# Altium schematic sheet Вариант3.SchDoc
size A4; SheetNumber: 3; SheetTotal: 10
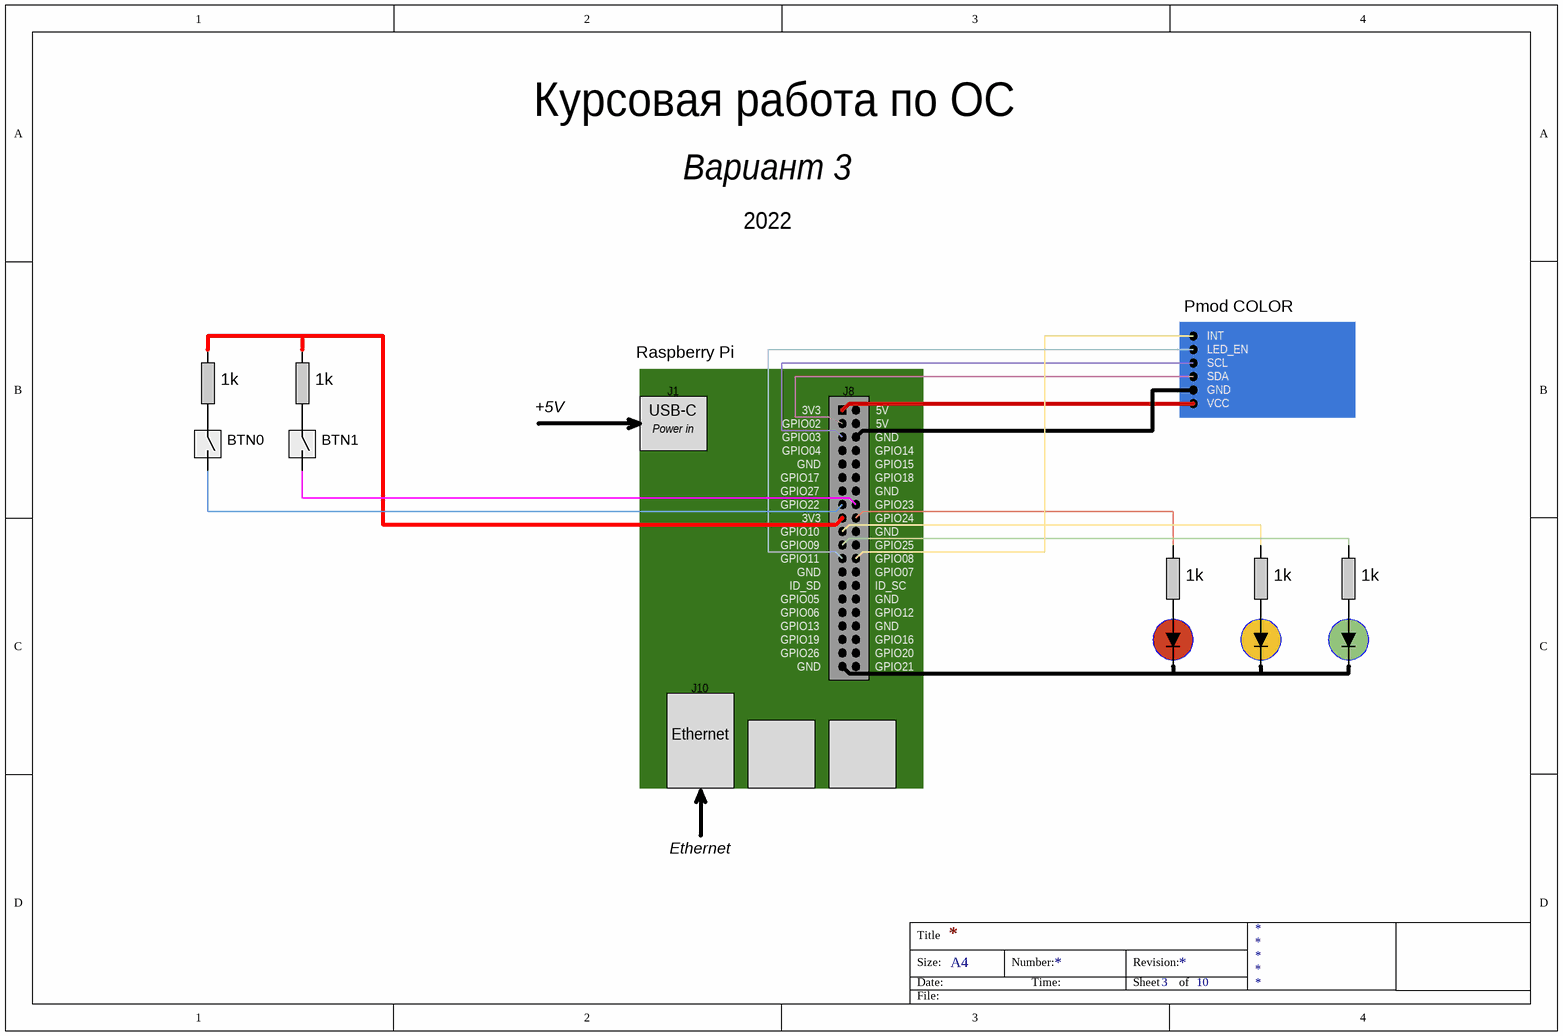
[diagram p0: Вариант3.SchDoc]

## Notes on the sheet
- Курсовая работа по ОС
- Вариант 3
- 2022
- Pmod COLOR
- 1k
- Raspberry Pi
- J1
- J8
- INT
- LED_EN
- SCL
- SDA
- GND
- BTN0
- BTN1
- +5V
- USB-C
- Power in
- 3V3
- GPIO02
- GPIO03
- GPIO04
- GPIO14
- 5V
- VCC
- GPIO17
- GPIO27
- GPIO22
- GPIO15
- GPIO18
- GPIO23
- GPIO24
- GPIO09
- GPIO10
- GPIO11
- ID_SD
- GPIO25
- GPIO08
- GPIO07
- ID_SC
- GPIO05
- GPIO06
- GPIO13
- GPIO19
- GPIO26
- GPIO12
- GPIO16
- GPIO20
- J10
- GPIO21
- Ethernet
- Title
- Size:
- Date:
- A4
- Number:
- Time:
- Revision:
- Sheet
- of
- File: